# Altium project SUDA-V3S.PrjPcb
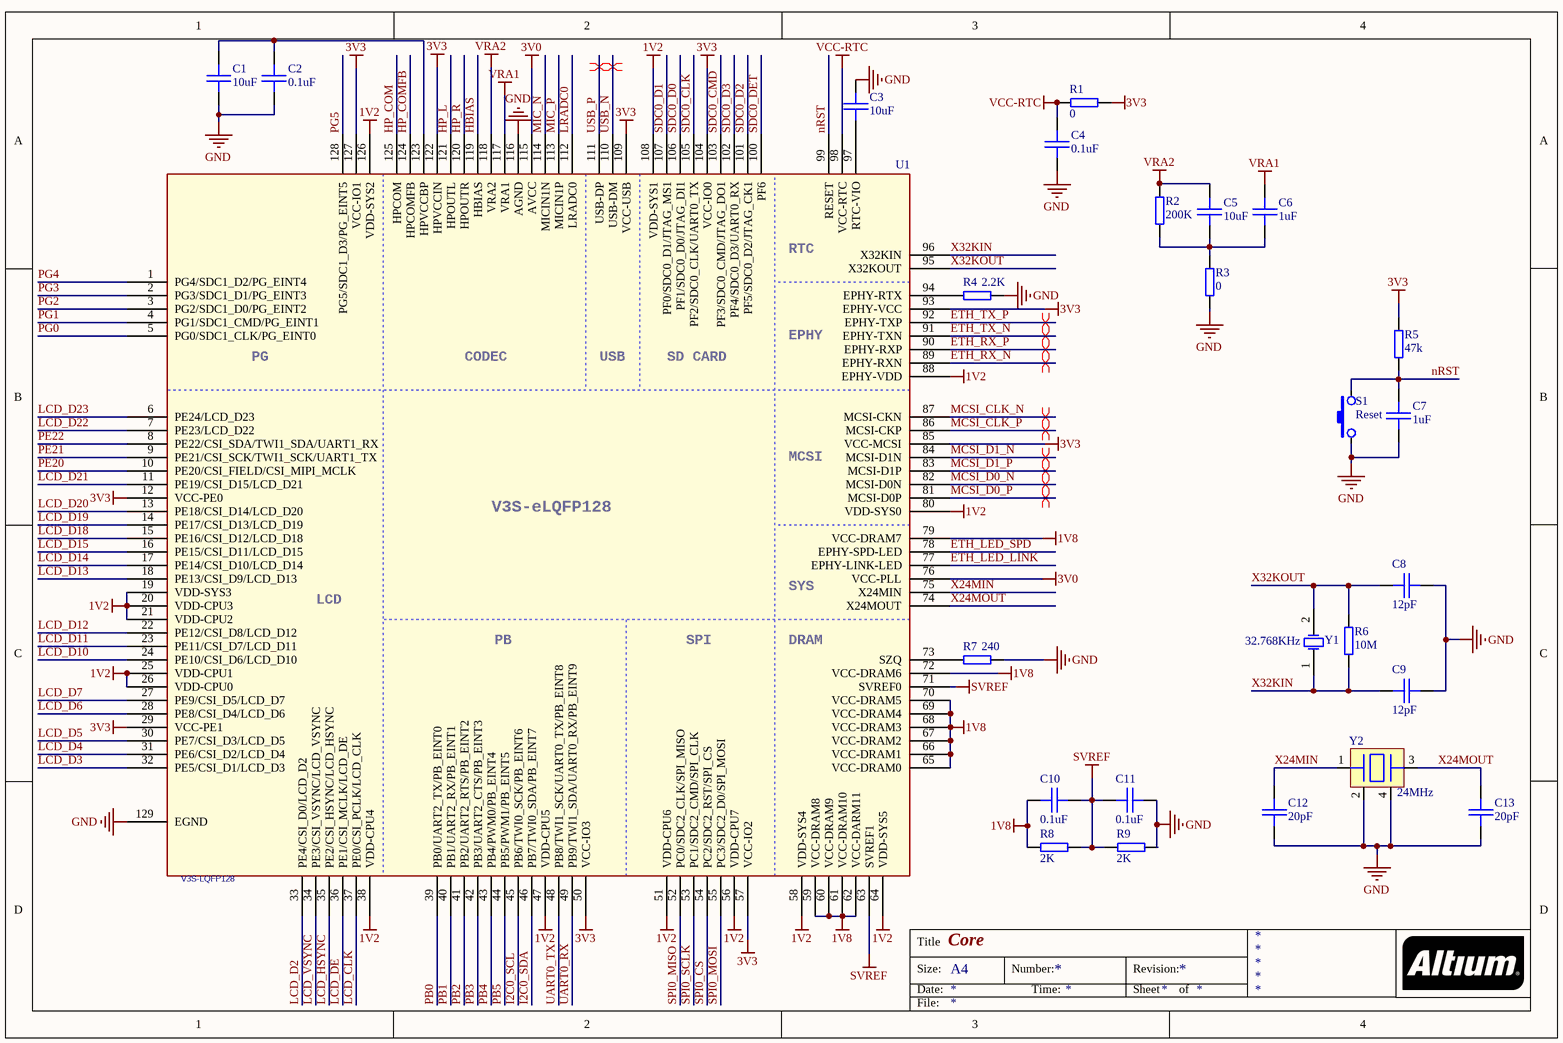
[diagram p0: Core.SchDoc]
8 sheets, 146 parts. Net scope: global (net labels, ports and power ports of the same name join across sheets).
Board file: SUDA_V3S.PcbDoc
Sheets:
  Core.SchDoc
  Power.SchDoc
  Misc.SchDoc
  LCD.SchDoc
  SD&USB.SchDoc
  Network.SchDoc
  MIC&Headphone.SchDoc
  Storage.SchDoc

## Sheet Core.SchDoc: Core
size A4

### Parts
C1  10uF  [CAP-0603]
C2  0.1uF  [CAP-0603]
C3  10uF  [CAP-0603]
C4  0.1uF  [CAP-0603]
C5  10uF  [CAP-0603]
C6  1uF  [CAP-0603]
C7  1uF  [CAP-0603]
C8  12pF  [CAP-0603]
C9  12pF  [CAP-0603]
C10  0.1uF  [CAP-0603]
C11  0.1uF  [CAP-0603]
C12  20pF  [CAP-0603]
C13  20pF  [CAP-0603]
R1  0  [RES-0603]
R2  200K  [RES-0603]
R3  0  [RES-0603]
R4  2.2K  [RES-0603]
R5  47k  [RES-0603]
R6  10M  [RES-0603]
R7  240  [RES-0603]
R8  2K  [RES-0603]
R9  2K  [RES-0603]
S1  Reset  [KEY_3X4X2]
U1  V3S-LQFP128  [QFP-128]
Y1  32.768KHz  [FC-135(3215)]
Y2  24MHz  [LC-SMD-3225_4P]

### Nets
1V2: U1.19(VDD-SYS3) U1.20(VDD-CPU3) U1.21(VDD-CPU2) U1.25(VDD-CPU1) U1.26(VDD-CPU0) U1.38(VDD-CPU4) U1.47(VDD-CPU5) U1.51(VDD-CPU6) U1.56(VDD-CPU7) U1.58(VDD-SYS4) U1.64(VDD-SYS5) U1.80(VDD-SYS0) U1.88(EPHY-VDD) U1.108(VDD-SYS1) U1.126(VDD-SYS2)
1V8: C10.1 R8.1 U1.59(VCC-DRAM8) U1.60(VCC-DRAM9) U1.61(VCC-DRAM10) U1.62(VCC-DARM11) U1.65(VCC-DRAM0) U1.66(VCC-DRAM1) U1.67(VCC-DRAM2) U1.68(VCC-DRAM3) U1.69(VCC-DRAM4) U1.70(VCC-DRAM5) U1.72(VCC-DRAM6) U1.79(VCC-DRAM7)
3V0: U1.76(VCC-PLL) U1.115(AVCC)
3V3: R1.2 R5.2 U1.12(VCC-PE0) U1.29(VCC-PE1) U1.50(VCC-IO3) U1.57(VCC-IO2) U1.85(VCC-MCSI) U1.93(EPHY-VCC) U1.104(VCC-IO0) U1.109(VCC-USB) U1.122(HPVCCIN) U1.127(VCC-IO1)
GND: C1.2 C2.2 C3.1 C4.2 C7.2 C8.2 C9.2 C11.2 C12.2 C13.2 R3.1 R4.2 R7.2 R9.2 S1.1 U1.116(AGND) U1.129(EGND) Y2.2 Y2.4
SVREF: C10.2 C11.1 R8.2 R9.1 U1.63(SVREF1) U1.71(SVREF0)
VCC-RTC: C4.1 R1.1 U1.98(VCC-RTC)
VRA1: C6.1 U1.117(VRA1)
VRA2: C5.1 R2.2 U1.118(VRA2)
ETH_LED_LINK: U1.77(EPHY-LINK-LED)
ETH_LED_SPD: U1.78(EPHY-SPD-LED)
ETH_RX_N: U1.89(EPHY-RXN)
ETH_RX_P: U1.90(EPHY-RXP)
ETH_TX_N: U1.91(EPHY-TXN)
ETH_TX_P: U1.92(EPHY-TXP)
HBIAS: U1.119(HBIAS)
HP_COM: U1.125(HPCOM)
HP_COMFB: U1.124(HPCOMFB)
HP_L: U1.121(HPOUTL)
HP_R: U1.120(HPOUTR)
I2C0_SCL: U1.45(PB6/TWI0_SCK/PB_EINT6)
I2C0_SDA: U1.46(PB7/TWI0_SDA/PB_EINT7)
LCD_CLK: U1.37(PE0/CSI_PCLK/LCD_CLK)
LCD_D2: U1.33(PE4/CSI_D0/LCD_D2)
LCD_D3: U1.32(PE5/CSI_D1/LCD_D3)
LCD_D4: U1.31(PE6/CSI_D2/LCD_D4)
LCD_D5: U1.30(PE7/CSI_D3/LCD_D5)
LCD_D6: U1.28(PE8/CSI_D4/LCD_D6)
LCD_D7: U1.27(PE9/CSI_D5/LCD_D7)
LCD_D10: U1.24(PE10/CSI_D6/LCD_D10)
LCD_D11: U1.23(PE11/CSI_D7/LCD_D11)
LCD_D12: U1.22(PE12/CSI_D8/LCD_D12)
LCD_D13: U1.18(PE13/CSI_D9/LCD_D13)
LCD_D14: U1.17(PE14/CSI_D10/LCD_D14)
LCD_D15: U1.16(PE15/CSI_D11/LCD_D15)
LCD_D18: U1.15(PE16/CSI_D12/LCD_D18)
LCD_D19: U1.14(PE17/CSI_D13/LCD_D19)
LCD_D20: U1.13(PE18/CSI_D14/LCD_D20)
LCD_D21: U1.11(PE19/CSI_D15/LCD_D21)
LCD_D22: U1.7(PE23/LCD_D22)
LCD_D23: U1.6(PE24/LCD_D23)
LCD_DE: U1.36(PE1/CSI_MCLK/LCD_DE)
LCD_HSYNC: U1.35(PE2/CSI_HSYNC/LCD_HSYNC)
LCD_VSYNC: U1.34(PE3/CSI_VSYNC/LCD_VSYNC)
LRADC0: U1.112(LRADC0)
MCSI_CLK_N: U1.87(MCSI-CKN)
MCSI_CLK_P: U1.86(MCSI-CKP)
MCSI_D0_N: U1.82(MCSI-D0N)
MCSI_D0_P: U1.81(MCSI-D0P)
MCSI_D1_N: U1.84(MCSI-D1N)
MCSI_D1_P: U1.83(MCSI-D1P)
MIC_N: U1.114(MICIN1N)
MIC_P: U1.113(MICIN1P)
nRST: C7.1 R5.1 S1.2 U1.99(RESET)
PB0: U1.39(PB0/UART2_TX/PB_EINT0)
PB1: U1.40(PB1/UART2_RX/PB_EINT1)
PB2: U1.41(PB2/UART2_RTS/PB_EINT2)
PB3: U1.42(PB3/UART2_CTS/PB_EINT3)
PB4: U1.43(PB4/PWM0/PB_EINT4)
PB5: U1.44(PB5/PWM1/PB_EINT5)
PE20: U1.10(PE20/CSI_FIELD/CSI_MIPI_MCLK)
PE21: U1.9(PE21/CSI_SCK/TWI1_SCK/UART1_TX)
PE22: U1.8(PE22/CSI_SDA/TWI1_SDA/UART1_RX)
PG0: U1.5(PG0/SDC1_CLK/PG_EINT0)
PG1: U1.4(PG1/SDC1_CMD/PG_EINT1)
PG2: U1.3(PG2/SDC1_D0/PG_EINT2)
PG3: U1.2(PG3/SDC1_D1/PG_EINT3)
PG4: U1.1(PG4/SDC1_D2/PG_EINT4)
PG5: U1.128(PG5/SDC1_D3/PG_EINT5)
SDC0_CLK: U1.105(PF2/SDC0_CLK/UART0_TX)
SDC0_CMD: U1.103(PF3/SDC0_CMD/JTAG_DO1)
SDC0_D0: U1.106(PF1/SDC0_D0/JTAG_DI1)
SDC0_D1: U1.107(PF0/SDC0_D1/JTAG_MS1)
SDC0_D2: U1.101(PF5/SDC0_D2/JTAG_CK1)
SDC0_D3: U1.102(PF4/SDC0_D3/UART0_RX)
SDC0_DET: U1.100(PF6)
SPI0_CS: U1.54(PC2/SDC2_RST/SPI_CS)
SPI0_MISO: U1.52(PC0/SDC2_CLK/SPI_MISO)
SPI0_MOSI: U1.55(PC3/SDC2_D0/SPI_MOSI)
SPI0_SCLK: U1.53(PC1/SDC2_CMD/SPI_CLK)
UART0_RX: U1.49(PB9/TWI1_SDA/UART0_RX/PB_EINT9)
UART0_TX: U1.48(PB8/TWI1_SCK/UART0_TX/PB_EINT8)
USB_N: U1.110(USB-DM)
USB_P: U1.111(USB-DP)
X24MIN: C12.1 U1.75(X24MIN) Y2.1
X24MOUT: C13.1 U1.74(X24MOUT) Y2.3
X32KIN: C9.1 R6.1 U1.96(X32KIN) Y1.1(OSC1)
X32KOUT: C8.1 R6.2 U1.95(X32KOUT) Y1.2(OSC2)
NetC1_1: C1.1 C2.1 U1.123(HPVCCBP)
NetC3_2: C3.2 U1.97(RTC-VIO)
NetC5_2: C5.2 C6.2 R2.1 R3.2
NetR4_1: R4.1 U1.94(EPHY-RTX)
NetR7_1: R7.1 U1.73(SZQ)

### Layout directives
differential pair: ETH_RX_N, ETH_RX_P, ETH_TX_N, ETH_TX_P, MCSI_CLK_N, MCSI_CLK_P, MCSI_D0_N, MCSI_D0_P, MCSI_D1_N, MCSI_D1_P, USB_N, USB_P

### Notes on the sheet
- Title
- Size:
- Date:
- A4
- Number:
- Time:
- Revision:
- Sheet
- of
- File:
- (in symbol V3S-LQFP128) RTC; EPHY; PG; CODEC; USB; SD CARD; MCSI; V3S-eLQFP128; SYS; LCD; PB; SPI; DRAM

### Library data of the parts
C1-C13 = C_0603: 陶瓷贴片电容0603; tolerance: 10%; voltage: 50V; ESR: 1.73mOhm; IRMS: 5.59A; Series: X7R
  C1 C3 C5: C_value: 10uF
  C2 C4 C10 C11: C_value: 0.1uF
  C6 C7: C_value: 1uF
  C8 C9: C_value: 12pF
  C12 C13: C_value: 20pF
R1-R9 = R_0603: 贴片电阻0603; tolerance: 5%; voltage: 50V; power: 0.063W
  R1 R3: R_value: 0
  R2: R_value: 200K
  R4: R_value: 2.2K
  R5: R_value: 47k
  R6: R_value: 10M
  R7: R_value: 240
  R8 R9: R_value: 2K
S1 = KEY: 轻触开关3X4X2
U1 = V3S-LQFP128: Allwinner V3S SoC
Y1 = OSC_32768: 32.768KHz时钟晶振; X_value: 32.768KHz
Y2 = XTAL_PASSIVE: 贴片无源晶振(3225); X_value: 24MHz

## Sheet Power.SchDoc: Power
size A4
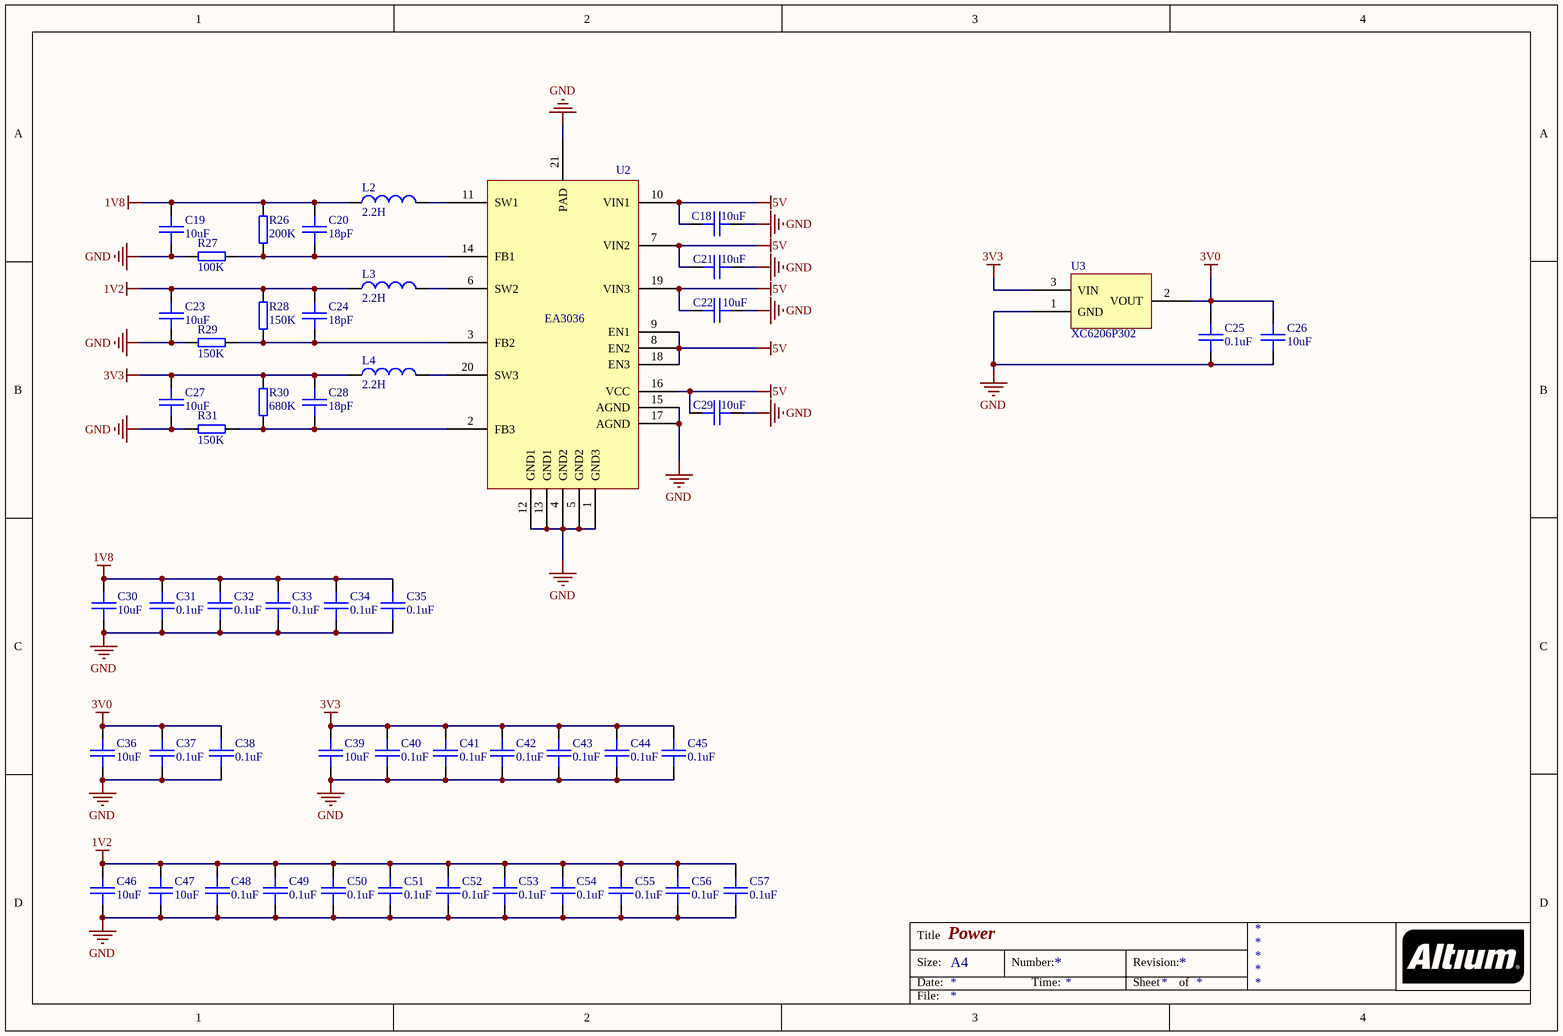
[diagram p1: Power.SchDoc]

### Parts
C18  10uF  [CAP-1206]
C19  10uF  [CAP-1206]
C20  18pF  [CAP-0603]
C21  10uF  [CAP-1206]
C22  10uF  [CAP-1206]
C23  10uF  [CAP-1206]
C24  18pF  [CAP-0603]
C25  0.1uF  [CAP-0603]
C26  10uF  [CAP-1206]
C27  10uF  [CAP-1206]
C28  18pF  [CAP-0603]
C29  10uF  [CAP-1206]
C30  10uF  [CAP-0603]
C31  0.1uF  [CAP-0603]
C32  0.1uF  [CAP-0603]
C33  0.1uF  [CAP-0603]
C34  0.1uF  [CAP-0603]
C35  0.1uF  [CAP-0603]
C36  10uF  [CAP-0603]
C37  0.1uF  [CAP-0603]
C38  0.1uF  [CAP-0603]
C39  10uF  [CAP-0603]
C40  0.1uF  [CAP-0603]
C41  0.1uF  [CAP-0603]
C42  0.1uF  [CAP-0603]
C43  0.1uF  [CAP-0603]
C44  0.1uF  [CAP-0603]
C45  0.1uF  [CAP-0603]
C46  10uF  [CAP-0603]
C47  10uF  [CAP-0603]
C48  0.1uF  [CAP-0603]
C49  0.1uF  [CAP-0603]
C50  0.1uF  [CAP-0603]
C51  0.1uF  [CAP-0603]
C52  0.1uF  [CAP-0603]
C53  0.1uF  [CAP-0603]
C54  0.1uF  [CAP-0603]
C55  0.1uF  [CAP-0603]
C56  0.1uF  [CAP-0603]
C57  0.1uF  [CAP-0603]
L2  2.2H  [L-PWR-6028]
L3  2.2H  [L-PWR-6028]
L4  2.2H  [L-PWR-6028]
R26  200K  [RES-0603]
R27  100K  [RES-0603]
R28  150K  [RES-0603]
R29  150K  [RES-0603]
R30  680K  [RES-0603]
R31  150K  [RES-0603]
U2  EA3036  [QFN20-3X3]
U3  XC6206P302  [SOT-23-3L]

### Nets
1V2: C23.2 C24.1 C46.1 C47.1 C48.1 C49.1 C50.1 C51.1 C52.1 C53.1 C54.1 C55.1 C56.1 C57.1 L3.1 R28.2
1V8: C19.2 C20.1 C30.1 C31.1 C32.1 C33.1 C34.1 C35.1 L2.1 R26.2
3V0: C25.1 C26.1 C36.1 C37.1 C38.1 U3.2(VOUT)
3V3: C27.2 C28.1 C39.1 C40.1 C41.1 C42.1 C43.1 C44.1 C45.1 L4.1 R30.2 U3.3(VIN)
5V: C18.2 C21.2 C22.2 C29.2 U2.7(VIN2) U2.8(EN2) U2.9(EN1) U2.10(VIN1) U2.16(VCC) U2.18(EN3) U2.19(VIN3)
GND: C18.1 C19.1 C21.1 C22.1 C23.1 C25.2 C26.2 C27.1 C29.1 C30.2 C31.2 C32.2 C33.2 C34.2 C35.2 C36.2 C37.2 C38.2 C39.2 C40.2 C41.2 C42.2 C43.2 C44.2 C45.2 C46.2 C47.2 C48.2 C49.2 C50.2 C51.2 C52.2 C53.2 C54.2 C55.2 C56.2 C57.2 R27.2 R29.2 R31.2 U2.1(GND3) U2.4(GND2) U2.5(GND2) U2.12(GND1) U2.13(GND1) U2.15(AGND) U2.17(AGND) U2.21(PAD) U3.1(GND)
NetC20_2: C20.2 R26.1 R27.1 U2.14(FB1)
NetC24_2: C24.2 R28.1 R29.1 U2.3(FB2)
NetC28_2: C28.2 R30.1 R31.1 U2.2(FB3)
NetL2_2: L2.2 U2.11(SW1)
NetL3_2: L3.2 U2.6(SW2)
NetL4_2: L4.2 U2.20(SW3)

### Notes on the sheet
- Title
- Size:
- Date:
- A4
- Number:
- Time:
- Revision:
- Sheet
- of
- File:

### Library data of the parts
C18 C19 C21-C23 C26 C27 C29 = C_1206: 陶瓷贴片电容1206; tolerance: 10%; voltage: 50V; C_value: 10uF
C20 C24 C25 C28 C30-C57 = C_0603: as C1 on sheet Core; Series: X7R
  C20 C24 C28: C_value: 18pF
  C25 C31-C35 C37 C38 C40-C45 C48-C57: C_value: 0.1uF
  C30 C36 C39 C46 C47: C_value: 10uF
L2-L4 = L_Power: 功率电感; DCR: 0.1Ohm; IDC: 2.7A; tolerance: 20%; L_value: 2.2H
R26-R31 = R_0603: as R1 on sheet Core
  R26: R_value: 200K
  R27: R_value: 100K
  R28 R29 R31: R_value: 150K
  R30: R_value: 680K
U2 = EA3036: 3CH Power Management IC
U3 = XC6206: XC6206 LDO=3V

## Sheet Misc.SchDoc: Misc
size A4
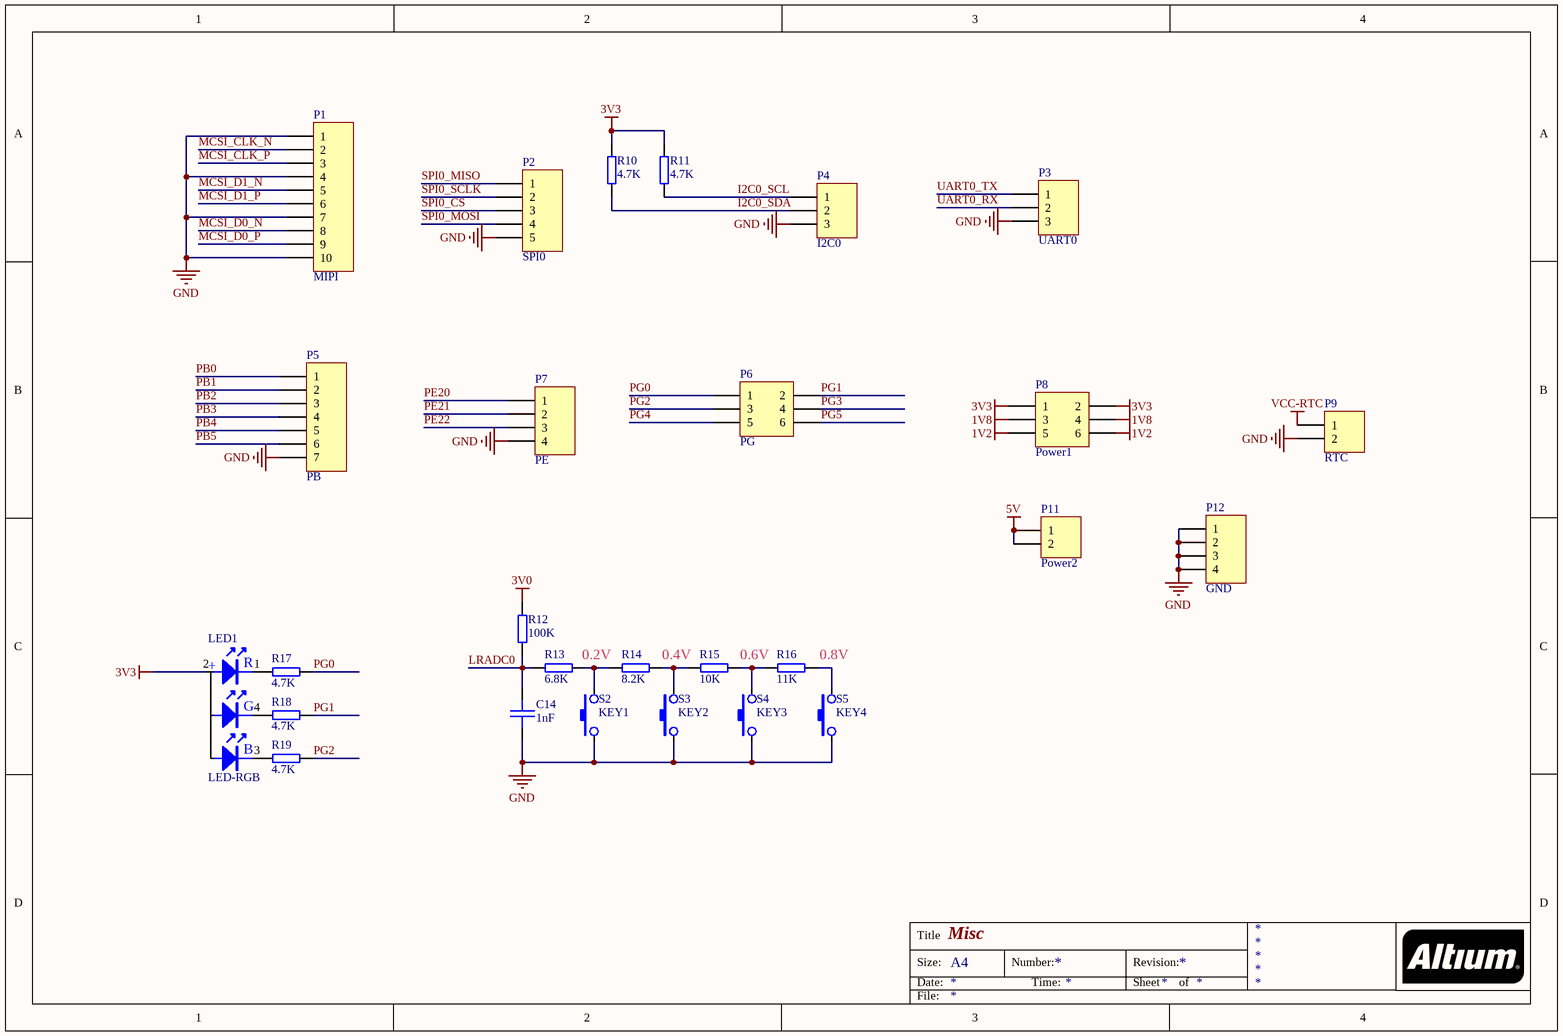
[diagram p2: Misc.SchDoc]

### Parts
C14  1nF  [CAP-0603]
LED1  LED-RGB  [LED-RGB-3528]
P1  MIPI  [HDR1X10]
P2  SPI0  [HDR1X5]
P3  UART0  [HDR1X3]
P4  I2C0  [HDR1X3]
P5  PB  [HDR1X7]
P6  PG  [HDR2X3]
P7  PE  [HDR1X4]
P8  Power1  [HDR2X3]
P9  RTC  [HDR1X2]
P11  Power2  [HDR1X2]
P12  GND  [HDR1X4]
R10  4.7K  [RES-0603]
R11  4.7K  [RES-0603]
R12  100K  [RES-0603]
R13  6.8K  [RES-0603]
R14  8.2K  [RES-0603]
R15  10K  [RES-0603]
R16  11K  [RES-0603]
R17  4.7K  [RES-0603]
R18  4.7K  [RES-0603]
R19  4.7K  [RES-0603]
S2  KEY1  [KEY_3X4X2]
S3  KEY2  [KEY_3X4X2]
S4  KEY3  [KEY_3X4X2]
S5  KEY4  [KEY_3X4X2]

### Nets
1V2: P8.5 P8.6
1V8: P8.3 P8.4
3V0: R12.2
3V3: LED1.2(+) P8.1 P8.2 R10.2 R11.2
5V: P11.1 P11.2
GND: C14.2 P1.1 P1.4 P1.7 P1.10 P2.5 P3.3 P4.3 P5.7 P7.4 P9.2 P12.1 P12.2 P12.3 P12.4 S2.1 S3.1 S4.1 S5.1
VCC-RTC: P9.1
I2C0_SCL: P4.1 R11.1
I2C0_SDA: P4.2 R10.1
LRADC0: C14.1 R12.1 R13.2
MCSI_CLK_N: P1.2
MCSI_CLK_P: P1.3
MCSI_D0_N: P1.8
MCSI_D0_P: P1.9
MCSI_D1_N: P1.5
MCSI_D1_P: P1.6
PB0: P5.1
PB1: P5.2
PB2: P5.3
PB3: P5.4
PB4: P5.5
PB5: P5.6
PE20: P7.1
PE21: P7.2
PE22: P7.3
PG0: P6.1 R17.2
PG1: P6.2 R18.2
PG2: P6.3 R19.2
PG3: P6.4
PG4: P6.5
PG5: P6.6
SPI0_CS: P2.3
SPI0_MISO: P2.1
SPI0_MOSI: P2.4
SPI0_SCLK: P2.2
UART0_RX: P3.2
UART0_TX: P3.1
NetLED1_1: LED1.1(R) R17.1
NetLED1_3: LED1.3(B) R19.1
NetLED1_4: LED1.4(G) R18.1
NetR13_1: R13.1 R14.2 S2.2
NetR14_1: R14.1 R15.2 S3.2
NetR15_1: R15.1 R16.2 S4.2
NetR16_1: R16.1 S5.2

### Notes on the sheet
- 0.2V
- 0.4V
- 0.6V
- (near R16) 0.8V
- Title
- Size:
- Date:
- A4
- Number:
- Time:
- Revision:
- Sheet
- of
- File:

### Library data of the parts
C14 = C_0603: as C1 on sheet Core; C_value: 1nF; Series: X7R
LED1 = LED-RGB: RGB发光二极管
P1 = Header 10: Header, 10-Pin; LatestRevisionDate: 17-Jul-2002; LatestRevisionNote: Re-released for DXP Platform.; Publisher: Altium Limited
P2 = Header 5: Header, 5-Pin; LatestRevisionDate: 17-Jul-2002; LatestRevisionNote: Re-released for DXP Platform.; Publisher: Altium Limited
P3 P4 = Header 3: Header, 3-Pin; LatestRevisionDate: 17-Jul-2002; LatestRevisionNote: Re-released for DXP Platform.; Publisher: Altium Limited
P5 = Header 7: Header, 7-Pin; LatestRevisionDate: 17-Jul-2002; LatestRevisionNote: Re-released for DXP Platform.; Publisher: Altium Limited
P6 P8 = Header 3X2: Header, 3-Pin, Dual row; LatestRevisionDate: 17-Jul-2002; LatestRevisionNote: Re-released for DXP Platform.; Publisher: Altium Limited
P7 P12 = Header 4: Header, 4-Pin; LatestRevisionDate: 17-Jul-2002; LatestRevisionNote: Re-released for DXP Platform.; Publisher: Altium Limited
P9 P11 = Header 2: Header, 2-Pin; LatestRevisionDate: 17-Jul-2002; LatestRevisionNote: Re-released for DXP Platform.; Publisher: Altium Limited
R10-R19 = R_0603: as R1 on sheet Core
  R10 R11 R17-R19: R_value: 4.7K
  R12: R_value: 100K
  R13: R_value: 6.8K
  R14: R_value: 8.2K
  R15: R_value: 10K
  R16: R_value: 11K
S2-S5 = KEY: 轻触开关3X4X2

## Sheet LCD.SchDoc: LCD
size A4
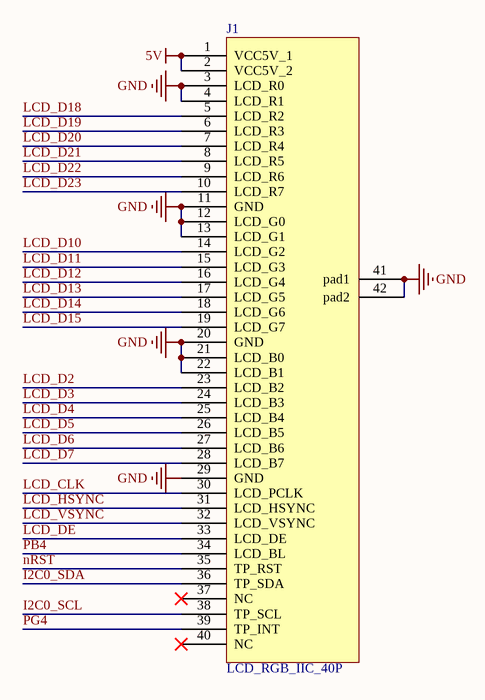
[diagram p3: LCD.SchDoc]

### Parts
J1  LCD_RGB_IIC_40P  [FPC_40P]

### Nets
5V: J1.1(VCC5V_1) J1.2(VCC5V_2)
GND: J1.3(LCD_R0) J1.4(LCD_R1) J1.11(GND) J1.12(LCD_G0) J1.13(LCD_G1) J1.20(GND) J1.21(LCD_B0) J1.22(LCD_B1) J1.29(GND) J1.41(pad1) J1.42(pad2)
I2C0_SCL: J1.38(TP_SCL)
I2C0_SDA: J1.36(TP_SDA)
LCD_CLK: J1.30(LCD_PCLK)
LCD_D2: J1.23(LCD_B2)
LCD_D3: J1.24(LCD_B3)
LCD_D4: J1.25(LCD_B4)
LCD_D5: J1.26(LCD_B5)
LCD_D6: J1.27(LCD_B6)
LCD_D7: J1.28(LCD_B7)
LCD_D10: J1.14(LCD_G2)
LCD_D11: J1.15(LCD_G3)
LCD_D12: J1.16(LCD_G4)
LCD_D13: J1.17(LCD_G5)
LCD_D14: J1.18(LCD_G6)
LCD_D15: J1.19(LCD_G7)
LCD_D18: J1.5(LCD_R2)
LCD_D19: J1.6(LCD_R3)
LCD_D20: J1.7(LCD_R4)
LCD_D21: J1.8(LCD_R5)
LCD_D22: J1.9(LCD_R6)
LCD_D23: J1.10(LCD_R7)
LCD_DE: J1.33(LCD_DE)
LCD_HSYNC: J1.31(LCD_HSYNC)
LCD_VSYNC: J1.32(LCD_VSYNC)
nRST: J1.35(TP_RST)
PB4: J1.34(LCD_BL)
PG4: J1.39(TP_INT)

Not connected (* = marked no-connect by the designer): J1 37(NC)* 40(NC)*

### Notes on the sheet
- Title
- Size:
- Date:
- A4
- Number:
- Time:
- Revision:
- Sheet
- of
- File:

### Library data of the parts
J1 = LCD_RGB_IIC_40P: 自制LCD接口,RGB+IIC触摸，40P

## Sheet SD&USB.SchDoc: SD&USB
size A4
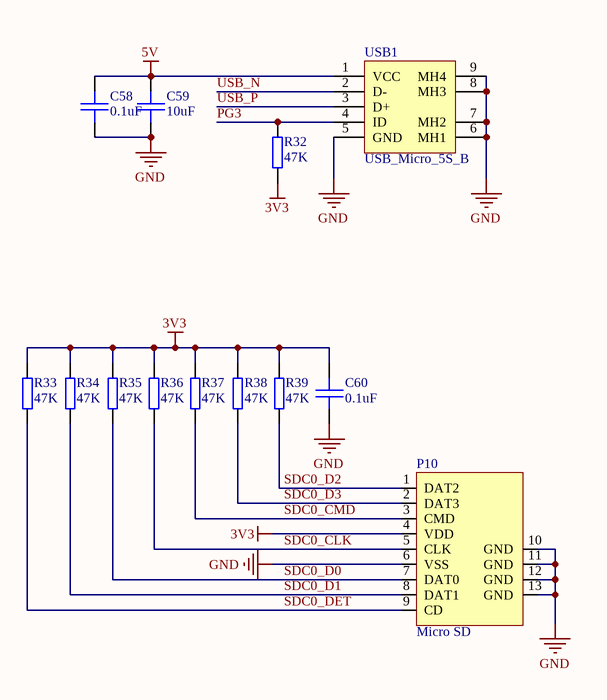
[diagram p4: SD&USB.SchDoc]

### Parts
C58  0.1uF  [CAP-0603]
C59  10uF  [CAP-1206]
C60  0.1uF  [CAP-0603]
P10  Micro SD  [7MSDP-B0-1012]
R32  47K  [RES-0603]
R33  47K  [RES-0603]
R34  47K  [RES-0603]
R35  47K  [RES-0603]
R36  47K  [RES-0603]
R37  47K  [RES-0603]
R38  47K  [RES-0603]
R39  47K  [RES-0603]
USB1  USB_Micro_5S_B  [USB_MICRO_5S_B]

### Nets
3V3: C60.1 P10.4(VDD) R32.2 R33.2 R34.2 R35.2 R36.2 R37.2 R38.2 R39.2
5V: C58.1 C59.1 USB1.1(VCC)
GND: C58.2 C59.2 C60.2 P10.6(VSS) P10.10(GND) P10.11(GND) P10.12(GND) P10.13(GND) USB1.5(GND) USB1.6(MH1) USB1.7(MH2) USB1.8(MH3) USB1.9(MH4)
PG3: R32.1 USB1.4(ID)
SDC0_CLK: P10.5(CLK) R36.1
SDC0_CMD: P10.3(CMD) R37.1
SDC0_D0: P10.7(DAT0) R35.1
SDC0_D1: P10.8(DAT1) R34.1
SDC0_D2: P10.1(DAT2) R39.1
SDC0_D3: P10.2(DAT3) R38.1
SDC0_DET: P10.9(CD) R33.1
USB_N: USB1.2(D-)
USB_P: USB1.3(D+)

### Notes on the sheet
- Title
- Size:
- Date:
- A4
- Number:
- Time:
- Revision:
- Sheet
- of
- File:

### Library data of the parts
C58 C60 = C_0603: as C1 on sheet Core; C_value: 0.1uF; Series: X7R
C59 = C_1206: 陶瓷贴片电容1206; tolerance: 10%; voltage: 50V; C_value: 10uF
P10 = Micro SD: Micro SD卡座
R32-R39 = R_0603: as R1 on sheet Core; R_value: 47K
USB1 = USB_Micro_5S_B: micro USB母座5SB型

## Sheet Network.SchDoc: Network
size A4
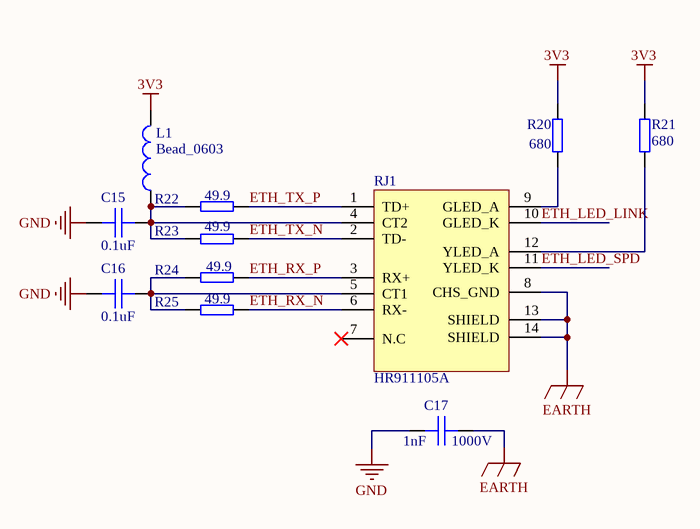
[diagram p5: Network.SchDoc]

### Parts
C15  0.1uF  [CAP-0603]
C16  0.1uF  [CAP-0603]
C17  1nF  voltage: 1000V  [CAP-1206]
L1  Bead_0603  [L-0603]
R20  680  [RES-0603]
R21  680  [RES-0603]
R22  49.9  [RES-0603]
R23  49.9  [RES-0603]
R24  49.9  [RES-0603]
R25  49.9  [RES-0603]
RJ1  HR911105A  [HR911105A]

### Nets
3V3: L1.2 R20.2 R21.1
EARTH: C17.2 RJ1.8(CHS_GND) RJ1.13(SHIELD) RJ1.14(SHIELD)
GND: C15.1 C16.1 C17.1
ETH_LED_LINK: RJ1.10(GLED_K)
ETH_LED_SPD: RJ1.11(YLED_K)
ETH_RX_N: R25.1 RJ1.6(RX-)
ETH_RX_P: R24.1 RJ1.3(RX+)
ETH_TX_N: R23.1 RJ1.2(TD-)
ETH_TX_P: R22.1 RJ1.1(TD+)
NetC15_2: C15.2 L1.1 R22.2 R23.2 RJ1.4(CT2)
NetC16_2: C16.2 R24.2 R25.2 RJ1.5(CT1)
NetR20_1: R20.1 RJ1.9(GLED_A)
NetR21_2: R21.2 RJ1.12(YLED_A)

Not connected (* = marked no-connect by the designer): RJ1 7(N.C)*

### Notes on the sheet
- Title
- Size:
- Date:
- A4
- Number:
- Time:
- Revision:
- Sheet
- of
- File:

### Library data of the parts
C15 C16 = C_0603: as C1 on sheet Core; C_value: 0.1uF; Series: X7R
C17 = C_1206: 陶瓷贴片电容1206; tolerance: 10%; C_value: 1nF
L1 = Bead_0603: 贴片磁珠0603; Impedance: 120Ohm; Current: 2A
R20-R25 = R_0603: as R1 on sheet Core
  R20 R21: R_value: 680
  R22-R25: R_value: 49.9
RJ1 = HR911105A: Header, 8-Pin, Dual row; LatestRevisionDate: 17-Jul-2002; LatestRevisionNote: Re-released for DXP Platform.; Publisher: Altium Limited

## Sheet MIC&Headphone.SchDoc: MIC&Headphone
size A4
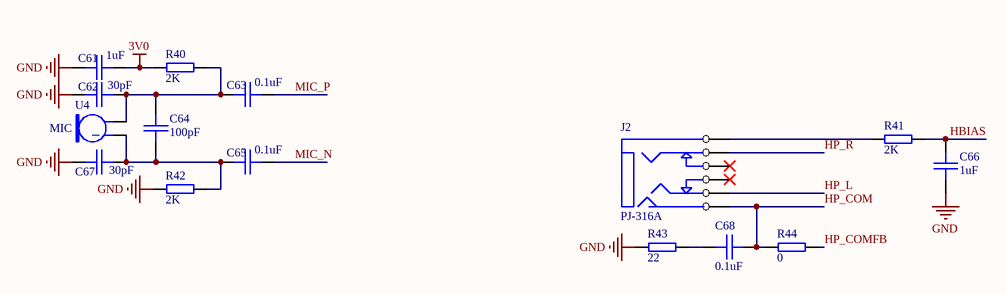
[diagram p6: MIC&Headphone.SchDoc]

### Parts
C61  1uF  [CAP-0603]
C62  30pF  [CAP-0603]
C63  0.1uF  [CAP-0603]
C64  100pF  [CAP-0603]
C65  0.1uF  [CAP-0603]
C66  1uF  [CAP-0603]
C67  30pF  [CAP-0603]
C68  0.1uF  [CAP-0603]
J2  PJ-316A  [PJ-316A]
R40  2K  [RES-0603]
R41  2K  [RES-0603]
R42  2K  [RES-0603]
R43  22  [RES-0603]
R44  0  [RES-0603]
U4  MIC  [MIC_9767]

### Nets
3V0: C61.2 R40.1
GND: C61.1 C62.1 C66.1 C67.1 R42.1 R43.1
HBIAS: C66.2 R41.2
HP_COM: C68.2 J2.4(MIC) R44.1
HP_COMFB: R44.2
HP_L: J2.2(L)
HP_R: J2.3(R)
MIC_N: C65.2
MIC_P: C63.2
NetC62_2: C62.2 C63.1 C64.2 R40.2 U4.2
NetC64_1: C64.1 C65.1 C67.2 R42.2 U4.1
NetC68_1: C68.1 R43.2
NetJ2_1: J2.1(GND) R41.1

Not connected (* = marked no-connect by the designer): J2 5(L_DET)* 6(R_DET)*

### Notes on the sheet
- Title
- Size:
- Date:
- A4
- Number:
- Time:
- Revision:
- Sheet
- of
- File:

### Library data of the parts
C61-C68 = C_0603: as C1 on sheet Core; Series: X7R
  C61 C66: C_value: 1uF
  C62 C67: C_value: 30pF
  C63 C65 C68: C_value: 0.1uF
  C64: C_value: 100pF
J2 = PJ-316A: 音频接口，左右声道+麦克
R40-R44 = R_0603: as R1 on sheet Core
  R40-R42: R_value: 2K
  R43: R_value: 22
  R44: R_value: 0
U4 = MIC: 咪头

## Sheet Storage.SchDoc: Storage
size A4
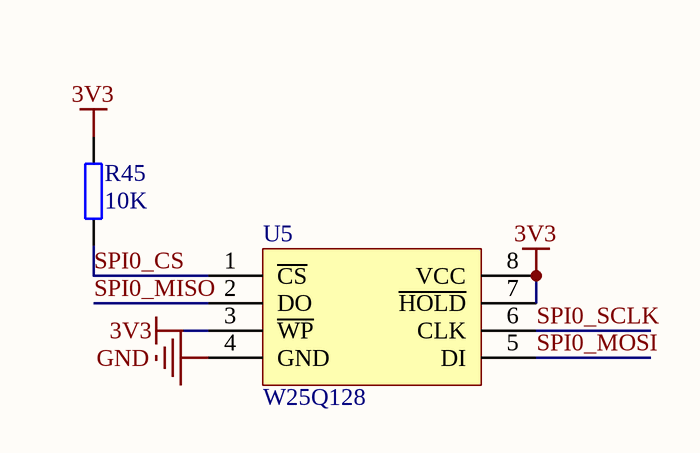
[diagram p7: Storage.SchDoc]

### Parts
R45  10K  [RES-0603]
U5  W25Q128  [LC-SOP-8_208mil]

### Nets
3V3: R45.2 U5.3(~{WP}) U5.7(~{HOLD}) U5.8(VCC)
GND: U5.4(GND)
SPI0_CS: R45.1 U5.1(~{CS})
SPI0_MISO: U5.2(DO)
SPI0_MOSI: U5.5(DI)
SPI0_SCLK: U5.6(CLK)

### Notes on the sheet
- Title
- Size:
- Date:
- A4
- Number:
- Time:
- Revision:
- Sheet
- of
- File:

### Library data of the parts
R45 = R_0603: as R1 on sheet Core; R_value: 10K
U5 = W25Q128: 128Mbits SPI Flash

## Nets that join several sheets
1V2: Core (15 pins), Power (16 pins), Misc (P8.5 P8.6)
1V8: Core (14 pins), Power (10 pins), Misc (P8.3 P8.4)
3V0: Core (U1.76 U1.115), Power (6 pins), Misc (R12.2), MIC&Headphone (C61.2 R40.1)
3V3: Core (12 pins), Power (12 pins), Misc (5 pins), SD&USB (10 pins), Network (L1.2 R20.2 R21.1), Storage (R45.2 U5.3 U5.7 U5.8)
5V: Power (11 pins), Misc (P11.1 P11.2), LCD (J1.1 J1.2), SD&USB (C58.1 C59.1 USB1.1)
GND: Core (19 pins), Power (49 pins), Misc (19 pins), LCD (11 pins), SD&USB (13 pins), Network (C15.1 C16.1 C17.1), MIC&Headphone (6 pins), Storage (U5.4)
VCC-RTC: Core (C4.1 R1.1 U1.98), Misc (P9.1)
ETH_LED_LINK: Core (U1.77), Network (RJ1.10)
ETH_LED_SPD: Core (U1.78), Network (RJ1.11)
ETH_RX_N: Core (U1.89), Network (R25.1 RJ1.6)
ETH_RX_P: Core (U1.90), Network (R24.1 RJ1.3)
ETH_TX_N: Core (U1.91), Network (R23.1 RJ1.2)
ETH_TX_P: Core (U1.92), Network (R22.1 RJ1.1)
HBIAS: Core (U1.119), MIC&Headphone (C66.2 R41.2)
HP_COM: Core (U1.125), MIC&Headphone (C68.2 J2.4 R44.1)
HP_COMFB: Core (U1.124), MIC&Headphone (R44.2)
HP_L: Core (U1.121), MIC&Headphone (J2.2)
HP_R: Core (U1.120), MIC&Headphone (J2.3)
I2C0_SCL: Core (U1.45), Misc (P4.1 R11.1), LCD (J1.38)
I2C0_SDA: Core (U1.46), Misc (P4.2 R10.1), LCD (J1.36)
LCD_CLK: Core (U1.37), LCD (J1.30)
LCD_D2: Core (U1.33), LCD (J1.23)
LCD_D3: Core (U1.32), LCD (J1.24)
LCD_D4: Core (U1.31), LCD (J1.25)
LCD_D5: Core (U1.30), LCD (J1.26)
LCD_D6: Core (U1.28), LCD (J1.27)
LCD_D7: Core (U1.27), LCD (J1.28)
LCD_D10: Core (U1.24), LCD (J1.14)
LCD_D11: Core (U1.23), LCD (J1.15)
LCD_D12: Core (U1.22), LCD (J1.16)
LCD_D13: Core (U1.18), LCD (J1.17)
LCD_D14: Core (U1.17), LCD (J1.18)
LCD_D15: Core (U1.16), LCD (J1.19)
LCD_D18: Core (U1.15), LCD (J1.5)
LCD_D19: Core (U1.14), LCD (J1.6)
LCD_D20: Core (U1.13), LCD (J1.7)
LCD_D21: Core (U1.11), LCD (J1.8)
LCD_D22: Core (U1.7), LCD (J1.9)
LCD_D23: Core (U1.6), LCD (J1.10)
LCD_DE: Core (U1.36), LCD (J1.33)
LCD_HSYNC: Core (U1.35), LCD (J1.31)
LCD_VSYNC: Core (U1.34), LCD (J1.32)
LRADC0: Core (U1.112), Misc (C14.1 R12.1 R13.2)
MCSI_CLK_N: Core (U1.87), Misc (P1.2)
MCSI_CLK_P: Core (U1.86), Misc (P1.3)
MCSI_D0_N: Core (U1.82), Misc (P1.8)
MCSI_D0_P: Core (U1.81), Misc (P1.9)
MCSI_D1_N: Core (U1.84), Misc (P1.5)
MCSI_D1_P: Core (U1.83), Misc (P1.6)
MIC_N: Core (U1.114), MIC&Headphone (C65.2)
MIC_P: Core (U1.113), MIC&Headphone (C63.2)
nRST: Core (C7.1 R5.1 S1.2 U1.99), LCD (J1.35)
PB0: Core (U1.39), Misc (P5.1)
PB1: Core (U1.40), Misc (P5.2)
PB2: Core (U1.41), Misc (P5.3)
PB3: Core (U1.42), Misc (P5.4)
PB4: Core (U1.43), Misc (P5.5), LCD (J1.34)
PB5: Core (U1.44), Misc (P5.6)
PE20: Core (U1.10), Misc (P7.1)
PE21: Core (U1.9), Misc (P7.2)
PE22: Core (U1.8), Misc (P7.3)
PG0: Core (U1.5), Misc (P6.1 R17.2)
PG1: Core (U1.4), Misc (P6.2 R18.2)
PG2: Core (U1.3), Misc (P6.3 R19.2)
PG3: Core (U1.2), Misc (P6.4), SD&USB (R32.1 USB1.4)
PG4: Core (U1.1), Misc (P6.5), LCD (J1.39)
PG5: Core (U1.128), Misc (P6.6)
SDC0_CLK: Core (U1.105), SD&USB (P10.5 R36.1)
SDC0_CMD: Core (U1.103), SD&USB (P10.3 R37.1)
SDC0_D0: Core (U1.106), SD&USB (P10.7 R35.1)
SDC0_D1: Core (U1.107), SD&USB (P10.8 R34.1)
SDC0_D2: Core (U1.101), SD&USB (P10.1 R39.1)
SDC0_D3: Core (U1.102), SD&USB (P10.2 R38.1)
SDC0_DET: Core (U1.100), SD&USB (P10.9 R33.1)
SPI0_CS: Core (U1.54), Misc (P2.3), Storage (R45.1 U5.1)
SPI0_MISO: Core (U1.52), Misc (P2.1), Storage (U5.2)
SPI0_MOSI: Core (U1.55), Misc (P2.4), Storage (U5.5)
SPI0_SCLK: Core (U1.53), Misc (P2.2), Storage (U5.6)
UART0_RX: Core (U1.49), Misc (P3.2)
UART0_TX: Core (U1.48), Misc (P3.1)
USB_N: Core (U1.110), SD&USB (USB1.2)
USB_P: Core (U1.111), SD&USB (USB1.3)